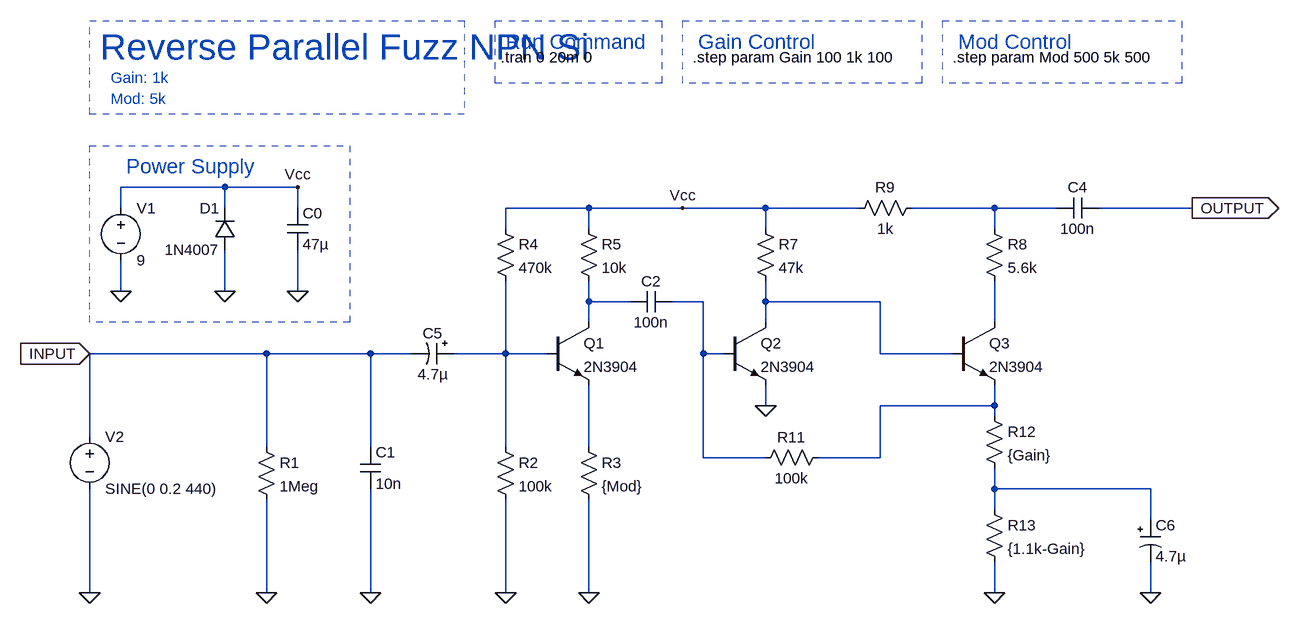
[diagram p0: schematic rp-fuzz-si.asc]
rp-fuzz-si.asc, the LTspice schematic file:
Version 4
SHEET 1 2620 1588
WIRE 896 944 736 944
WIRE 1008 944 896 944
WIRE 736 976 736 944
WIRE 896 976 896 944
WIRE 1008 976 1008 944
WIRE 1456 976 1328 976
WIRE 1600 976 1456 976
WIRE 1728 976 1600 976
WIRE 1872 976 1728 976
WIRE 2080 976 1952 976
WIRE 2176 976 2080 976
WIRE 2384 976 2240 976
WIRE 1328 1008 1328 976
WIRE 1456 1008 1456 976
WIRE 1728 1008 1728 976
WIRE 2080 1008 2080 976
WIRE 736 1104 736 1056
WIRE 896 1104 896 1040
WIRE 1008 1104 1008 1040
WIRE 1456 1120 1456 1088
WIRE 1520 1120 1456 1120
WIRE 1632 1120 1584 1120
WIRE 1728 1120 1728 1088
WIRE 1904 1120 1728 1120
WIRE 1456 1152 1456 1120
WIRE 1728 1152 1728 1120
WIRE 2080 1152 2080 1088
WIRE 960 1200 688 1200
WIRE 1120 1200 960 1200
WIRE 1184 1200 1120 1200
WIRE 1328 1200 1328 1088
WIRE 1328 1200 1248 1200
WIRE 1392 1200 1328 1200
WIRE 1632 1200 1632 1120
WIRE 1664 1200 1632 1200
WIRE 1904 1200 1904 1120
WIRE 2016 1200 1904 1200
WIRE 1728 1280 1728 1248
WIRE 2080 1280 2080 1248
WIRE 2080 1280 1904 1280
WIRE 2080 1296 2080 1280
WIRE 688 1328 688 1200
WIRE 960 1344 960 1200
WIRE 1120 1344 1120 1200
WIRE 1328 1344 1328 1200
WIRE 1456 1344 1456 1248
WIRE 1632 1360 1632 1200
WIRE 1728 1360 1632 1360
WIRE 1904 1360 1904 1280
WIRE 1904 1360 1808 1360
WIRE 2080 1408 2080 1376
WIRE 2320 1408 2080 1408
WIRE 2080 1440 2080 1408
WIRE 2320 1456 2320 1408
WIRE 688 1568 688 1408
WIRE 960 1568 960 1424
WIRE 1120 1568 1120 1408
WIRE 1328 1568 1328 1424
WIRE 1456 1568 1456 1424
WIRE 2080 1568 2080 1520
WIRE 2320 1568 2320 1520
FLAG 960 1568 0
FLAG 1120 1568 0
FLAG 1328 1568 0
FLAG 1456 1568 0
FLAG 1728 1280 0
FLAG 688 1568 0
FLAG 736 1104 0
FLAG 1008 1104 0
FLAG 2080 1568 0
FLAG 2320 1568 0
FLAG 2384 976 OUTPUT
IOPIN 2384 976 Out
FLAG 688 1200 INPUT
IOPIN 688 1200 In
FLAG 896 1104 0
FLAG 1008 944 Vcc
FLAG 1600 976 Vcc
SYMBOL npn 1392 1152 R0
SYMATTR InstName Q1
SYMATTR Value 2N3904
SYMBOL npn 1664 1152 R0
SYMATTR InstName Q2
SYMATTR Value 2N3904
SYMBOL npn 2016 1152 R0
SYMATTR InstName Q3
SYMATTR Value 2N3904
SYMBOL res 944 1328 R0
SYMATTR InstName R1
SYMATTR Value 1Meg
SYMBOL res 1312 1328 R0
SYMATTR InstName R2
SYMATTR Value 100k
SYMBOL res 1440 1328 R0
SYMATTR InstName R3
SYMATTR Value {Mod}
SYMBOL res 1312 992 R0
SYMATTR InstName R4
SYMATTR Value 470k
SYMBOL res 1440 992 R0
SYMATTR InstName R5
SYMATTR Value 10k
SYMBOL res 1712 992 R0
SYMATTR InstName R7
SYMATTR Value 47k
SYMBOL res 2064 992 R0
SYMATTR InstName R8
SYMATTR Value 5.6k
SYMBOL res 1968 960 R90
WINDOW 0 0 56 VBottom 2
WINDOW 3 32 56 VTop 2
SYMATTR InstName R9
SYMATTR Value 1k
SYMBOL res 1824 1344 R90
WINDOW 0 0 56 VBottom 2
WINDOW 3 32 56 VTop 2
SYMATTR InstName R11
SYMATTR Value 100k
SYMBOL cap 1104 1344 R0
SYMATTR InstName C1
SYMATTR Value 10n
SYMBOL cap 1584 1104 R90
WINDOW 0 0 32 VBottom 2
WINDOW 3 32 32 VTop 2
SYMATTR InstName C2
SYMATTR Value 100n
SYMBOL cap 2176 992 R270
WINDOW 0 32 32 VTop 2
WINDOW 3 0 32 VBottom 2
SYMATTR InstName C4
SYMATTR Value 100n
SYMBOL voltage 688 1312 R0
WINDOW 123 0 0 Left 0
WINDOW 39 0 0 Left 0
SYMATTR InstName V2
SYMATTR Value SINE(0 0.2 440)
SYMBOL voltage 736 960 R0
WINDOW 123 0 0 Left 0
WINDOW 39 0 0 Left 0
SYMATTR InstName V1
SYMATTR Value 9
SYMBOL cap 992 976 R0
SYMATTR InstName C0
SYMATTR Value 47µ
SYMBOL polcap 1248 1184 R90
WINDOW 0 0 32 VBottom 2
WINDOW 3 32 32 VTop 2
SYMATTR InstName C5
SYMATTR Value 4.7µ
SYMBOL polcap 2304 1456 R0
SYMATTR InstName C6
SYMATTR Value 4.7µ
SYMBOL res 2064 1280 R0
SYMATTR InstName R12
SYMATTR Value {Gain}
SYMBOL res 2064 1424 R0
SYMATTR InstName R13
SYMATTR Value {1.1k-Gain}
SYMBOL diode 912 1040 R180
WINDOW 0 24 64 Left 2
WINDOW 3 24 0 Left 2
SYMATTR InstName D1
SYMATTR Value 1N4007
TEXT 704 728 Left 5 ;Reverse Parallel Fuzz NPN Si
TEXT 1320 744 Left 2 !.tran 0 20m 0
TEXT 1616 744 Left 2 !.step param Gain 100 1k 100
TEXT 2016 744 Left 2 !.step param Mod 500 5k 500
TEXT 1328 720 Left 3 ;Run Command
TEXT 1624 720 Left 3 ;Gain Control
TEXT 2024 720 Left 3 ;Mod Control
TEXT 744 912 Left 3 ;Power Supply
TEXT 720 776 Left 2 ;Gain: 1k
TEXT 720 808 Left 2 ;Mod: 5k
RECTANGLE Normal 1088 1152 688 880 1
RECTANGLE Normal 1264 832 688 688 1
RECTANGLE Normal 1568 784 1312 688 1
RECTANGLE Normal 1968 784 1600 688 1
RECTANGLE Normal 2368 784 2000 688 1

The netlist it stands for:
* rp-fuzz-si.asc
Q1 N002 N006 N008 0 2N3904
Q2 N004 N003 0 0 2N3904
Q3 N005 N004 N007 0 2N3904
R1 INPUT 0 1Meg
R2 N006 0 100k
R3 N008 0 {Mod}
R4 Vcc N006 470k
R5 Vcc N002 10k
R7 Vcc N004 47k
R8 N001 N005 5.6k
R9 N001 Vcc 1k
R11 N007 N003 100k
C1 INPUT 0 10n
C2 N003 N002 100n
C4 N001 OUTPUT 100n
V2 INPUT 0 SINE(0 0.2 440)
V1 Vcc 0 9
C0 Vcc 0 47µ
C5 N006 INPUT 4.7µ
C6 N009 0 4.7µ
R12 N007 N009 {Gain}
R13 N009 0 {1.1k-Gain}
D1 0 Vcc 1N4007
.model D D
.lib standard.dio
.model NPN NPN
.model PNP PNP
.lib standard.bjt
* Reverse Parallel Fuzz NPN Si
.tran 0 20m 0
.step param Gain 100 1k 100
.step param Mod 500 5k 500
* Run Command
* Gain Control
* Mod Control
* Power Supply
* Gain: 1k
* Mod: 5k
.backanno
.end